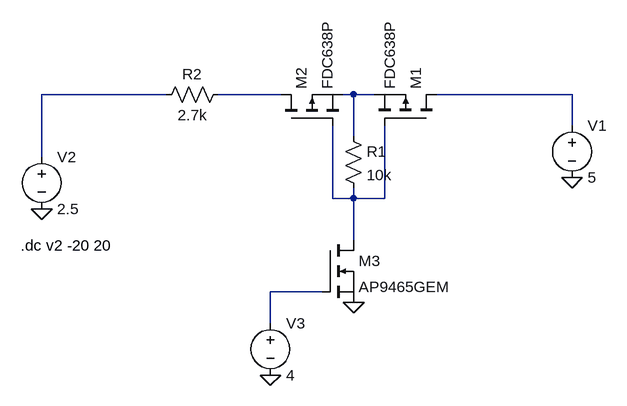
[diagram p0: schematic SelectablePullup.asc]
SelectablePullup.asc, the LTspice schematic file:
Version 4
SHEET 1 880 680
WIRE 32 64 -160 64
WIRE 208 64 112 64
WIRE 320 64 304 64
WIRE 352 64 320 64
WIRE 656 64 448 64
WIRE 656 112 656 64
WIRE 320 128 320 64
WIRE -160 160 -160 64
WIRE 288 224 288 112
WIRE 320 224 320 208
WIRE 320 224 288 224
WIRE 368 224 368 112
WIRE 368 224 320 224
WIRE 320 288 320 224
WIRE 272 368 192 368
WIRE 192 416 192 368
FLAG 656 192 0
FLAG -160 240 0
FLAG 320 384 0
FLAG 192 496 0
SYMBOL pmos 208 112 R270
SYMATTR InstName M2
SYMATTR Value FDC638P
SYMBOL pmos 448 112 M270
SYMATTR InstName M1
SYMATTR Value FDC638P
SYMBOL voltage 656 96 R0
WINDOW 123 0 0 Left 0
WINDOW 39 0 0 Left 0
SYMATTR InstName V1
SYMATTR Value 5
SYMBOL res 304 112 R0
SYMATTR InstName R1
SYMATTR Value 10k
SYMBOL res 128 48 R90
WINDOW 0 0 56 VBottom 2
WINDOW 3 32 56 VTop 2
SYMATTR InstName R2
SYMATTR Value 2.7k
SYMBOL voltage -160 144 R0
WINDOW 123 0 0 Left 0
WINDOW 39 0 0 Left 0
SYMATTR InstName V2
SYMATTR Value 2.5
SYMBOL nmos 272 288 R0
SYMATTR InstName M3
SYMATTR Value AP9465GEM
SYMBOL voltage 192 400 R0
WINDOW 123 0 0 Left 0
WINDOW 39 0 0 Left 0
SYMATTR InstName V3
SYMATTR Value 4
TEXT -192 296 Left 2 !.dc v2 -20 20

The netlist it stands for:
* SelectablePullup.asc
M2 N002 N005 N003 N003 FDC638P
M1 N004 N005 N003 N003 FDC638P
V1 N004 0 5
R1 N003 N005 10k
R2 N002 N001 2.7k
V2 N001 0 2.5
M3 N005 N006 0 0 AP9465GEM
V3 N006 0 4
.model NMOS NMOS
.model PMOS PMOS
.lib standard.mos
.dc v2 -20 20
.backanno
.end